# Altium schematic sheet top_sheet.schdoc
size 297 x 206 mm
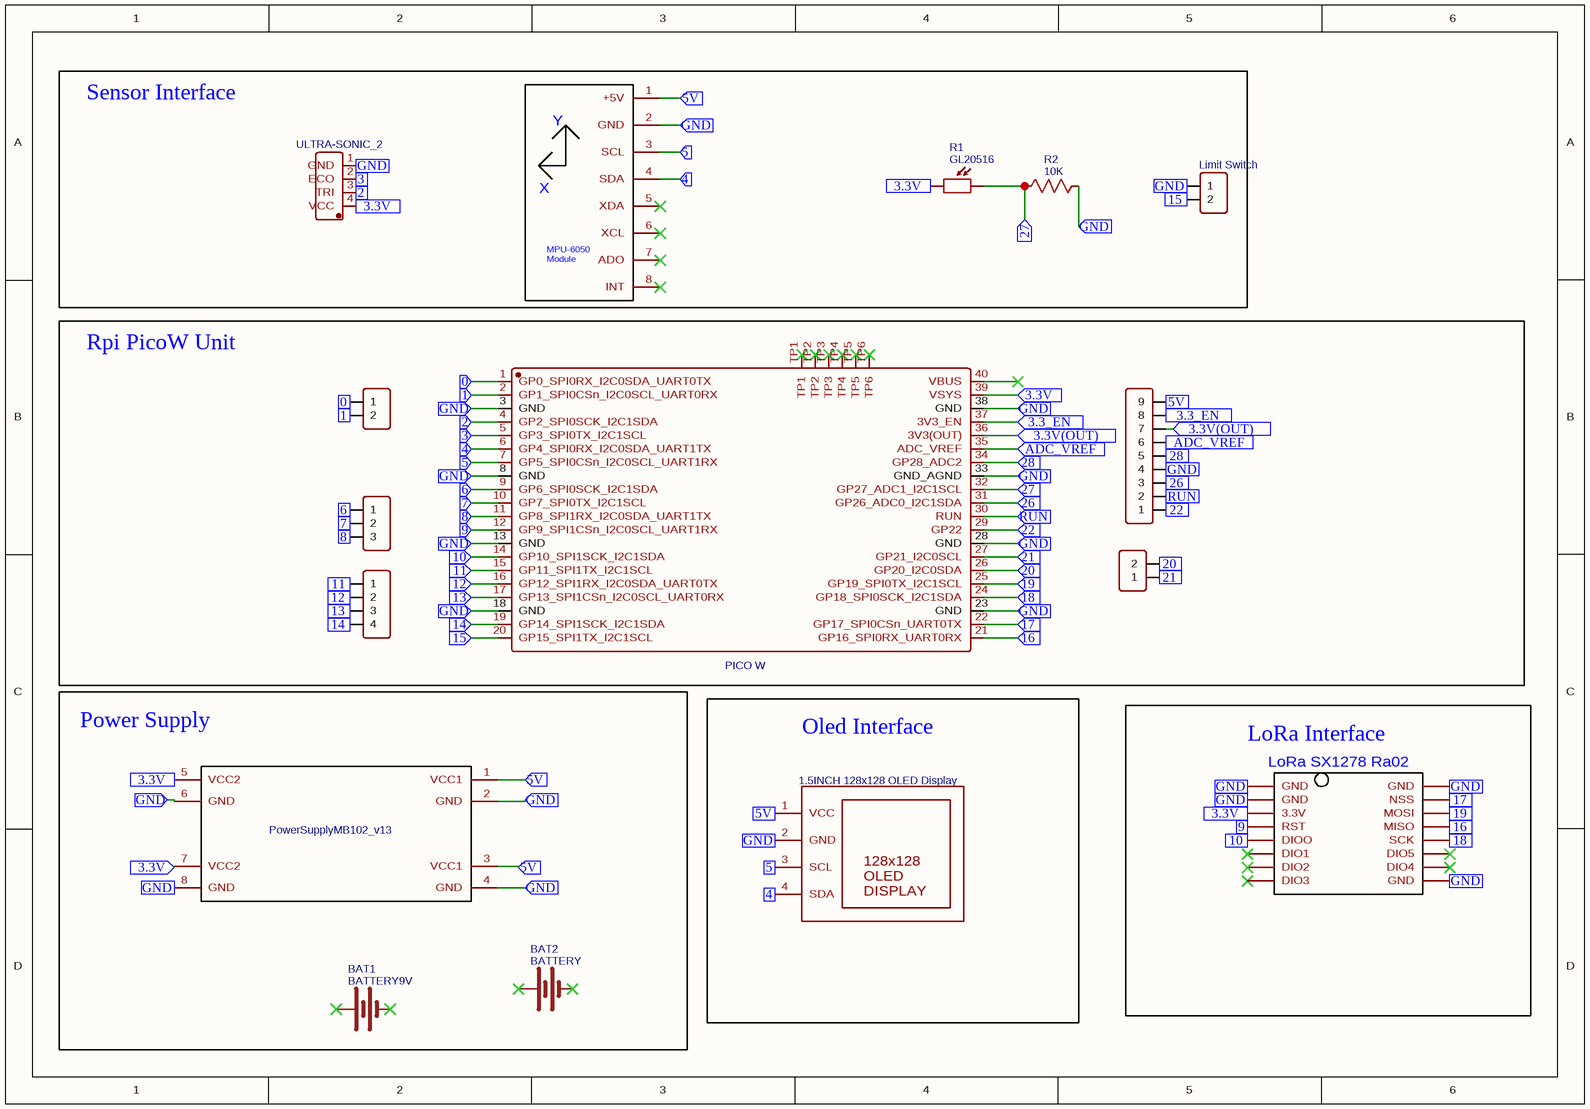
[diagram p0: top_sheet.schdoc]

## Parts
BAT1  BATTERY9V  [BATTCON_9V]
BAT2  BATTERY  [BATTCON_9V]
CN1  ULTRASONIC-HC-SR04  [ULTRASONIC-HC-SR04]  (value not drawn)
J1  Limit Switch  [HDR-M-2.54_1X2]
J2  HDR-M-2.54_1x2  [HDR-M-2.54_1X2]  (value not drawn)
J3  HDR-M-2.54_1x3  [HDR-M-2.54_1X3]  (value not drawn)
J4  HDR-M-2.54_1x4  [HDR-M-2.54_1X4]  (value not drawn)
J5  HDR-M-2.54_1x9  [HDR-M-2.54_1X9]  (value not drawn)
J6  HDR-M-2.54_1x2  [HDR-M-2.54_1X2]  (value not drawn)
R1  GL20516  [RES-TH_BD20.0-P15.50-D1.0]
R2  10K  [R_AXIAL-0.4]
U1  PICO W  [COMM-SMD_L51.0-W21.0-P2.54_PICOW]
U2  LoRa Ra-02  Module  [LORA RA02 SX1278 VINODREDDY]  (value not drawn)
U3  1.5INCH 128x128 OLED Display  [1.5INCH OLED MODULE I2C]
U4  MPU-6050 Module  [MPU-6050 MODULE]  (value not drawn)
U5  mb102 47,2  [POWERSUPPLYMB102 47,2]  (value not drawn)

## Blocks framed on the sheet
Sensor Interface: CN1 J1 R1 R2 U4
Rpi PicoW Unit: J2-J6 U1
Power Supply: BAT1 BAT2 U5
Oled Interface: U3
LoRa Interface: U2

## Ports
0 (in), 1 (in), 2 (in), 3 (in), 3.3_EN (in), 3.3V (in), 3.3V(OUT) (in), 4 (in), 5 (in), 5V (in), 6 (in), 7 (in), 8 (in), 9 (in), 10 (in), 11 (in), 12 (in), 13 (in), 14 (in), 15 (in), 16 (in), 17 (in), 18 (in), 19 (in), 20 (in), 21 (in), 22 (in), 26 (in), 27 (in), 28 (in), ADC_VREF (in), GND (in), RUN (in)

## Nets
0: J2.1 U1.1(GP0_SPI0RX_I2C0SDA_UART0TX) ; port 0
1: J2.2 U1.2(GP1_SPI0CSn_I2C0SCL_UART0RX) ; port 1
2: CN1.3(TRI) U1.4(GP2_SPI0SCK_I2C1SDA) ; port 2
3: CN1.2(ECO) U1.5(GP3_SPI0TX_I2C1SCL) ; port 3
3.3_EN: J5.8 U1.37(3V3_EN) ; port 3.3_EN
3.3V: CN1.4(VCC) R1.1 U1.39(VSYS) U2.3(3.3V) U5.5(VCC2) U5.7(VCC2) ; port 3.3V
3.3V(OUT): J5.7 U1.36(3V3(OUT)) ; port 3.3V(OUT)
4: U1.6(GP4_SPI0RX_I2C0SDA_UART1TX) U3.4(SDA) U4.4(SDA) ; port 4
5: U1.7(GP5_SPI0CSn_I2C0SCL_UART1RX) U3.3(SCL) U4.3(SCL) ; port 5
5V: J5.9 U3.1(VCC) U4.1(+5V) U5.1(VCC1) U5.3(VCC1) ; port 5V
6: J3.1 U1.9(GP6_SPI0SCK_I2C1SDA) ; port 6
7: J3.2 U1.10(GP7_SPI0TX_I2C1SCL) ; port 7
8: J3.3 U1.11(GP8_SPI1RX_I2C0SDA_UART1TX) ; port 8
9: U1.12(GP9_SPI1CSn_I2C0SCL_UART1RX) U2.4(RST) ; port 9
10: U1.14(GP10_SPI1SCK_I2C1SDA) U2.5(DIOO) ; port 10
11: J4.1 U1.15(GP11_SPI1TX_I2C1SCL) ; port 11
12: J4.2 U1.16(GP12_SPI1RX_I2C0SDA_UART0TX) ; port 12
13: J4.3 U1.17(GP13_SPI1CSn_I2C0SCL_UART0RX) ; port 13
14: J4.4 U1.19(GP14_SPI1SCK_I2C1SDA) ; port 14
15: J1.2 U1.20(GP15_SPI1TX_I2C1SCL) ; port 15
16: U1.21(GP16_SPI0RX_UART0RX) U2.13(MISO) ; port 16
17: U1.22(GP17_SPI0CSn_UART0TX) U2.15(NSS) ; port 17
18: U1.24(GP18_SPI0SCK_I2C1SDA) U2.12(SCK) ; port 18
19: U1.25(GP19_SPI0TX_I2C1SCL) U2.14(MOSI) ; port 19
20: J6.2 U1.26(GP20_I2C0SDA) ; port 20
21: J6.1 U1.27(GP21_I2C0SCL) ; port 21
22: J5.1 U1.29(GP22) ; port 22
26: J5.3 U1.31(GP26_ADC0_I2C1SDA) ; port 26
27: R1.2 R2.1 U1.32(GP27_ADC1_I2C1SCL) ; port 27
28: J5.5 U1.34(GP28_ADC2) ; port 28
ADC_VREF: J5.6 U1.35(ADC_VREF) ; port ADC_VREF
GND: CN1.1(GND) J1.1 J5.4 R2.2 U1.3(GND) U1.8(GND) U1.13(GND) U1.18(GND) U1.23(GND) U1.28(GND) U1.33(GND_AGND) U1.38(GND) U2.1(GND) U2.2(GND) U2.9(GND) U2.16(GND) U3.2(GND) U4.2(GND) U5.2(GND) U5.4(GND) U5.6(GND) U5.8(GND) ; port GND
RUN: J5.2 U1.30(RUN) ; port RUN

Not connected (* = marked no-connect by the designer): BAT1 +* -*; BAT2 +* -*; U1 40(VBUS)* TP1* TP2* TP3* TP4* TP5* TP6*; U2 6(DIO1)* 7(DIO2)* 8(DIO3)* 10(DIO4)* 11(DIO5)*; U4 5(XDA)* 6(XCL)* 7(ADO)* 8(INT)*

## Notes on the sheet
- (in symbol 1.5INCH 128x128 OLED Display) 128x128 / OLED / DISPLAY
- (in symbol LoRa Ra-02  Module) LoRa SX1278 Ra02
- (in symbol mb102 47,2) PowerSupplyMB102_v13
- (in symbol MPU-6050 Module) Y; X; MPU-6050 / Module
- (in symbol ULTRASONIC-HC-SR04) ULTRA-SONIC_2

## Library data of the parts
BAT1 = BATTERY9V: description: Battery Holders; Contributor: SparkFun; spicePre: B; spiceSymbolName: BATTERY9V
BAT2 = BATTERY: Contributor: SparkFun; spicePre: B; spiceSymbolName: BATTERY
CN1 = ULTRASONIC-HC-SR04: Manufacturer: kinghelm(金航标); Manufacturer Part: KH-CL0.5-H2.0-4PIN; Contributor: 22f2000814; Supplier: LCSC; Supplier Part: C2797192; JLCPCB Part Class: Extended Part; spicePre: C; spiceSymbolName: ULTRASONIC-HC-SR04
J1 = Limit Switch: Contributor: LCEDA_Lib; Supplier Part: C124375; Supplier: LCSC; spicePre: J; spiceSymbolName: HDR-M-2.54_1x2
J2 J6 = HDR-M-2.54_1x2: Contributor: LCEDA_Lib; Supplier Part: C124375; Supplier: LCSC; spicePre: J; spiceSymbolName: HDR-M-2.54_1x2
J3 = HDR-M-2.54_1x3: Contributor: LCEDA_Lib; Supplier Part: C180248; Supplier: LCSC; spicePre: J; spiceSymbolName: HDR-M-2.54_1x3
J4 = HDR-M-2.54_1x4: Contributor: LCEDA_Lib; Supplier Part: C124378; Supplier: LCSC; spicePre: J; spiceSymbolName: HDR-M-2.54_1x4
J5 = HDR-M-2.54_1x9: Contributor: LCEDA_Lib; Supplier Part: C225484; Supplier: LCSC; spicePre: J; spiceSymbolName: HDR-M-2.54_1x9
R1 = GL20516: Manufacturer: JCHL(晶创和立); Contributor: LCSC; Supplier: LCSC; Supplier Part: C779580; Manufacturer Part: GL20516; JLCPCB Part Class: Extended Part; spicePre: R; spiceSymbolName: GL20516
R2 = 10K: nameAlias: Value(Ω); Contributor: LCEDA_Lib; spicePre: R; spiceSymbolName: R_AXIAL-0.4_US
U1 = PICO W: Manufacturer: Raspberry Pi(树莓派); Contributor: lcsc; Supplier: LCSC; Supplier Part: C7203003; Manufacturer Part: PICO W; JLCPCB Part Class: Extended Part; spicePre: U; spiceSymbolName: PICO W
U2 = LoRa Ra-02  Module: Contributor: juanmartin1946; spicePre: U; spiceSymbolName: LoRa Ra-02  Module
U3 = 1.5INCH 128x128 OLED Display: Manufacturer: GoldenMorning; Manufacturer Part: GME128128-01-IIC; Contributor: neildelaroca2020; Supplier: AliExpress; Supplier Part: GME128128-01-IIC; link: https://nl.aliexpress.com/item/1005005017409307.html; spicePre: U; spiceSymbolName: 1.5INCH 128x128 OLED Display
U4 = MPU-6050 Module: Contributor: 22f2000814; sourceId: vtnFWQ8qI; timeStamp: 1451235162; spicePre: U; spiceSymbolName: MPU-6050 Module
U5 = mb102 47,2: Contributor: 22f2000814; spicePre: U; spiceSymbolName: mb102 47,2